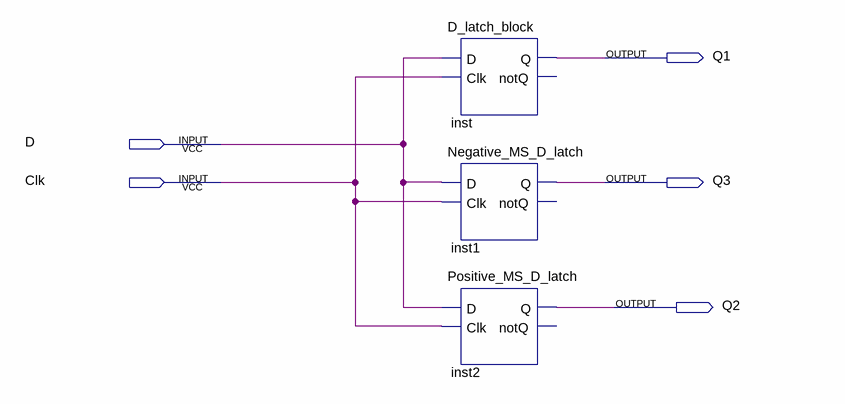
[diagram p0: schematic sheet]
// Quartus schematic comparison_block.bdf as structural Verilog: 3 symbols, 5 pins
module comparison_block (
  input  D,
  input  Clk,
  output Q1,
  output Q3,
  output Q2
);

  D_latch_block inst (.D(D), .Clk(Clk), .Q(Q1));  // open: notQ
  Negative_MS_D_latch inst1 (.D(D), .Clk(Clk), .Q(Q3));  // open: notQ
  Positive_MS_D_latch inst2 (.D(D), .Clk(Clk), .Q(Q2));  // open: notQ
endmodule
